# Altium schematic sheet EMFI_HCAL.SchDoc: Interlock Switch, LED
size Letter; Organization: NewAE Technology Inc.; Address1: 1083 Queen St., Suite 196; Address2: Halifax; Address3: NS; Address4: Canada B3H 0B2; SheetApproved: NO
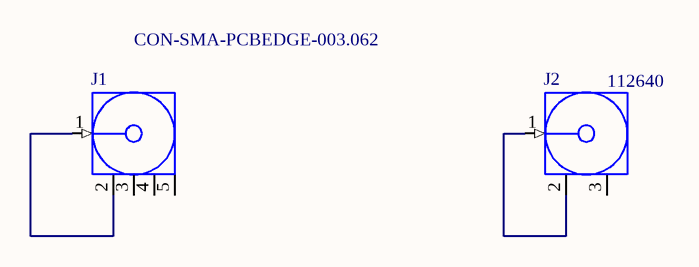
[diagram p0: EMFI_HCAL.SchDoc]

## Parts
J1  CON-SMA-PCBEDGE-003.062  [CON-SMA-MALE-PCB-EDGE062]
J2  112640  [BNC_EDGE_JACK]

## Nets
NetJ1_1: J1.1(Signal) J1.2(GND)
NetJ2_1: J2.1(Signal) J2.2(GND)

Not connected (* = marked no-connect by the designer): J1 3(GND) 4(GND) 5(GND); J2 3(GND)

## Notes on the sheet
- Title:
- Date:
- Rev:
- Time:
- Project:
- Sheet
- of
- License:
- Copyright © NewAE Technology Inc.
- Approved:
- NewAE.com
- File:

## Library data of the parts
J1 = CON-F-SMA-PCBEDGE-003.062: SMA MaleEdge Mount Connector for 0.062" Thick Board; Manufacture 1: Linx Technologies; Manufacture Part Number 1: CONSMA013.062; PCB_Layout: Pads complies with manufacturer's recommendation.; DatasheetVersion: rev1.0, Aug-2006; PackageVersion: rev1.0, Aug-2006; PackageReference: CON-SMA-EDGE062; PackageDescription: SMA Female Edge Mount Connector for 0.062" Thick Board, 7.9 mm Body Dia.; ComponentLink1Description: Manufacturer URL; ComponentLink1URL: http://www.linxtechnologies.com/; ComponentLink2Description: Datasheet; ComponentLink2URL: http://www.connectorcity.com/diagrams/SMA/CONSMA003.062.pdf; Part Number: CON-F-SMA-PCBEDGE-003.062; Component Group: Connector; Pin Count: 5; Supplier 1: Digi-Key; Supplier Part Number 1: CONSMA013.062-ND; Component Kind: Standard; Component Type: Standard
J2 = BNC_EDGE_MOUNT: BNC Connector Jack, Female Socket 50 Ohm Board Edge, End Launch Solder; Manufacture 1: Amphenol RF; PP Material Stack: 0; Part Number: BNC_EDGE_MOUNT; Component Group: Connector; Manufacture Part Number 1: 112640; Pin Count: 3; Supplier 1: Digi-Key; Supplier Part Number 1: ACX2259-ND; Component Kind: Standard; Component Type: Standard; PP Rotation: 0